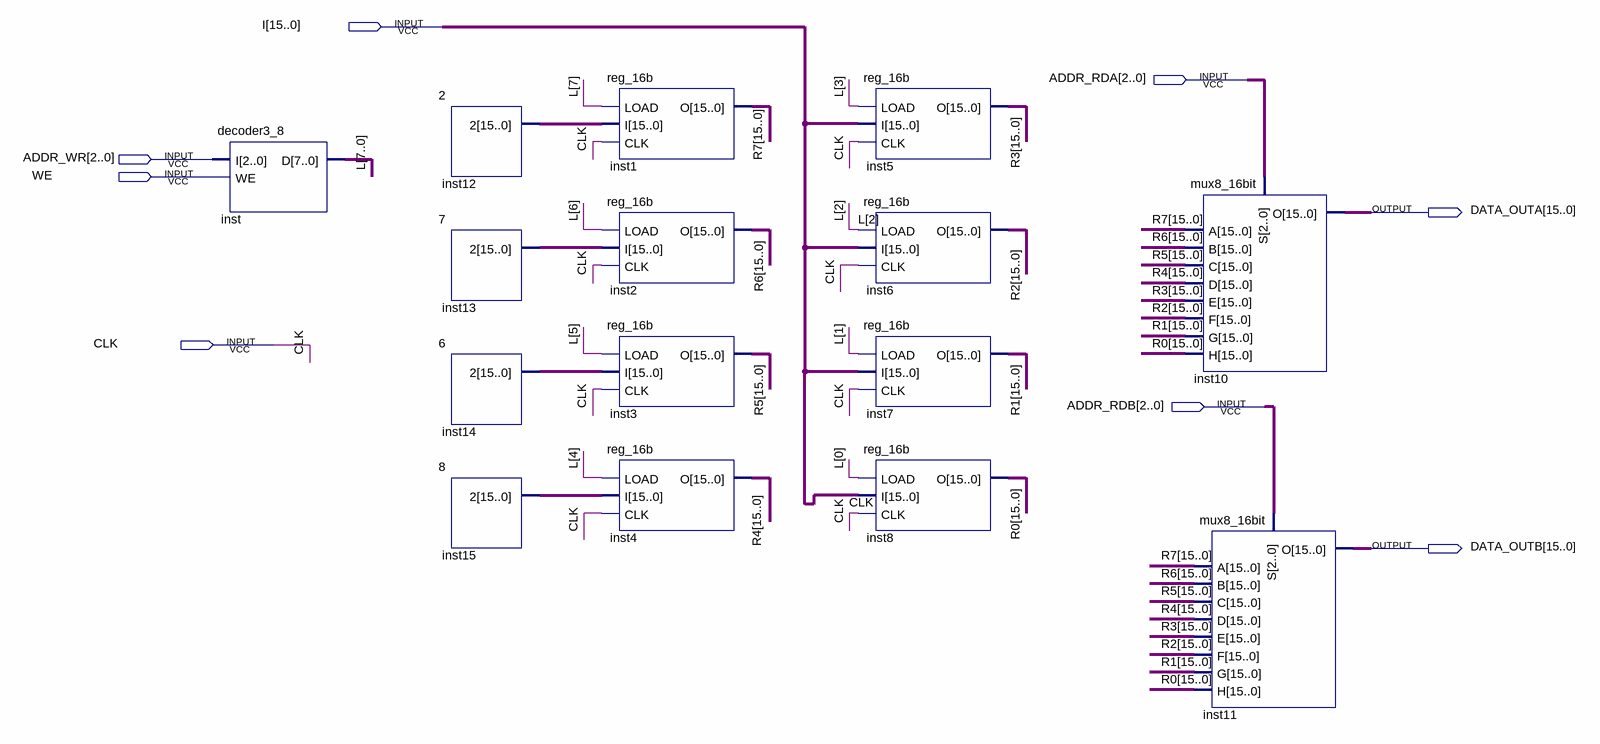
[diagram p0: schematic sheet]
// Quartus schematic RegFile.bdf as structural Verilog: 15 symbols, 8 pins
module RegFile (
  input  [15:0] I,
  input  [2:0] ADDR_RDA,
  input  [2:0] ADDR_WR,
  input  WE,
  input  CLK,
  input  [2:0] ADDR_RDB,
  output [15:0] DATA_OUTA,
  output [15:0] DATA_OUTB
);

  wire [7:0] L;
  wire [15:0] inst12_2, inst13_2, inst14_2, inst15_2, R0, R1, R2, R3, R4, R5, R6, R7;

  decoder3_8 inst (.I(ADDR_WR), .WE(WE), .D(L));
  \2  inst12 (.\2 (inst12_2));
  \7  inst13 (.\2 (inst13_2));
  \6  inst14 (.\2 (inst14_2));
  \8  inst15 (.\2 (inst15_2));
  reg_16b inst1 (.LOAD(L[7]), .I(inst12_2), .CLK(CLK), .O(R7));
  reg_16b inst2 (.LOAD(L[6]), .I(inst13_2), .CLK(CLK), .O(R6));
  reg_16b inst3 (.LOAD(L[5]), .I(inst14_2), .CLK(CLK), .O(R5));
  reg_16b inst4 (.LOAD(L[4]), .I(inst15_2), .CLK(CLK), .O(R4));
  reg_16b inst5 (.LOAD(L[3]), .I(I), .CLK(CLK), .O(R3));
  reg_16b inst6 (.LOAD(L[2]), .I(I), .CLK(CLK), .O(R2));
  reg_16b inst7 (.LOAD(L[1]), .I(I), .CLK(CLK), .O(R1));
  reg_16b inst8 (.LOAD(L[0]), .I(I), .CLK(CLK), .O(R0));
  mux8_16bit inst10 (.S(ADDR_RDA), .A(R7), .B(R6), .C(R5), .D(R4), .E(R3), .F(R2), .G(R1), .H(R0), .O(DATA_OUTA));
  mux8_16bit inst11 (.S(ADDR_RDB), .A(R7), .B(R6), .C(R5), .D(R4), .E(R3), .F(R2), .G(R1), .H(R0), .O(DATA_OUTB));
endmodule
